# Altium schematic sheet power-v5n.SchDoc: Power -5V
size Letter; CheckedBy: J. Brinton; CompanyName: Signal Laboratories, Inc.; DrawnBy: J. Brinton; Engineer: J. Brinton; Address1: 3479 Edison Way; Address2: Menlo Park CA 94025; Address3: +1 (877) 778-8435; Address4: siglabs.com; Revision: 3; SheetNumber: 45; SheetTotal: 49
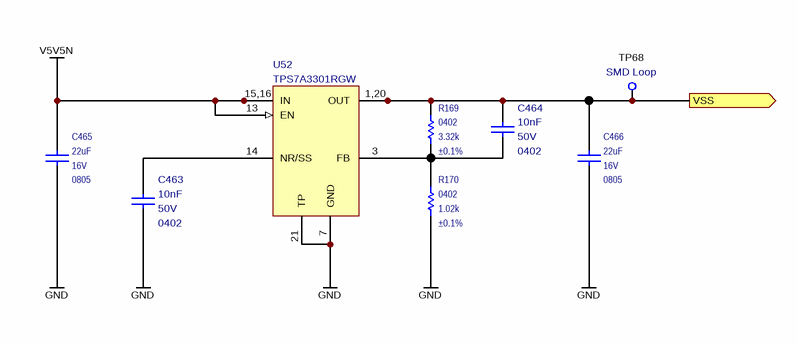
[diagram p0: power-v5n.SchDoc]

## Parts
C463  value 10nF  Package: 0402  Voltage: 50V  [CAPC100X50X55L25N]  (hidden comment: GRM155R71H103KA88)
C464  value 10nF  Package: 0402  Voltage: 50V  [CAPC100X50X55L25N]  (hidden comment: GRM155R71H103KA88)
C465  value 22uF  Voltage: 16V  Package: 0805  [CAPC200X125X145L45N]  (hidden comment: CL21A226KOQNNNE)
C466  value 22uF  Voltage: 16V  Package: 0805  [CAPC200X125X145L45N]  (hidden comment: CL21A226KOQNNNE)
R169  value 3.32k  Tolerance: ±0.1%  Package: 0402  [RESC1005X40N]  (hidden comment: RT0402BRD073K32L)
R170  value 1.02k  Tolerance: ±0.1%  Package: 0402  [RESC1005X40N]  (hidden comment: RT0402BRD071K02L)
TP68  Notes: SMD Loop  [5015]  (hidden comment: 5015)
U52  TPS7A3301RGW  [QFN65P500X500X100-21N]

## Ports
VSS (out)

## Nets
GND: C463.2 C465.1 C466.1 R170.1 U52.2(NC) U52.4(NC) U52.5(NC) U52.6(NC) U52.7(GND) U52.8(NC) U52.9(NC) U52.10(NC) U52.11(NC) U52.12(NC) U52.17(NC) U52.18(NC) U52.19(NC) U52.21(TP)
V5V5N: C465.2 U52.13(EN) U52.15(IN) U52.16(IN)
VSS: C464.1 C466.2 R169.2 TP68.1 U52.1(OUT) U52.20(OUT) ; port VSS
NetC463_1: C463.1 U52.14(NR/SS)
NetC464_2: C464.2 R169.1 R170.2 U52.3(FB)

## Notes on the sheet
- Title
- Engineer
- Revision
- Drawn By
- Checked By
- Date
- Sheet
- of
- (in symbol TPS7A3301RGWT) 15,16; 1,20

## Library data of the parts
C463 C464 = TMK105B7103KV: Ceramic Capacitor 10nF ±10% 50V X7R 0402; Manufacturer: Murata; Tr: -55:125; Manufacturer P/N: GRM155R71H103KA88; Tolerance: ±10%
C465 C466 = CAP 0603: Ceramic Capacitor 22uF ±10% 16V X5R 0805; Manufacturer: Samsung; Tr: -55:85; Manufacturer P/N: CL21A226KOQNNNE; Tolerance: ±10%
R169 = RES: Thin Film Resistor 3.32k +/-0.1% SMD 0402; Manufacturer: Yageo; Tr: -55:155; Power: 0.063W; Tcr: *; Manufacturer P/N: RT0402BRD073K32L; Alternatives: *; Voltage: *
R170 = RES: Thin Film Resistor 1.02k +/-0.1% SMD 0402; Manufacturer: Yageo; Tr: -55:155; Tcr: *; Manufacturer P/N: RT0402BRD071K02L; Alternatives: *; Voltage: *; Power: *
TP68 = TEST_POINT_SMD_50: Test Point SMD; Manufacturer: Keystone; Manufacturer P/N: 5015
U52 = TPS7A3301RGWT: Low-Dropout Linear Regulator 20-VQFN; Manufacturer: Texas Instruments; Package: VQFN-20; Manufacturer P/N: TPS7A3301RGW